# Altium project ProcessorBoard_STM32F103C.PrjPcb
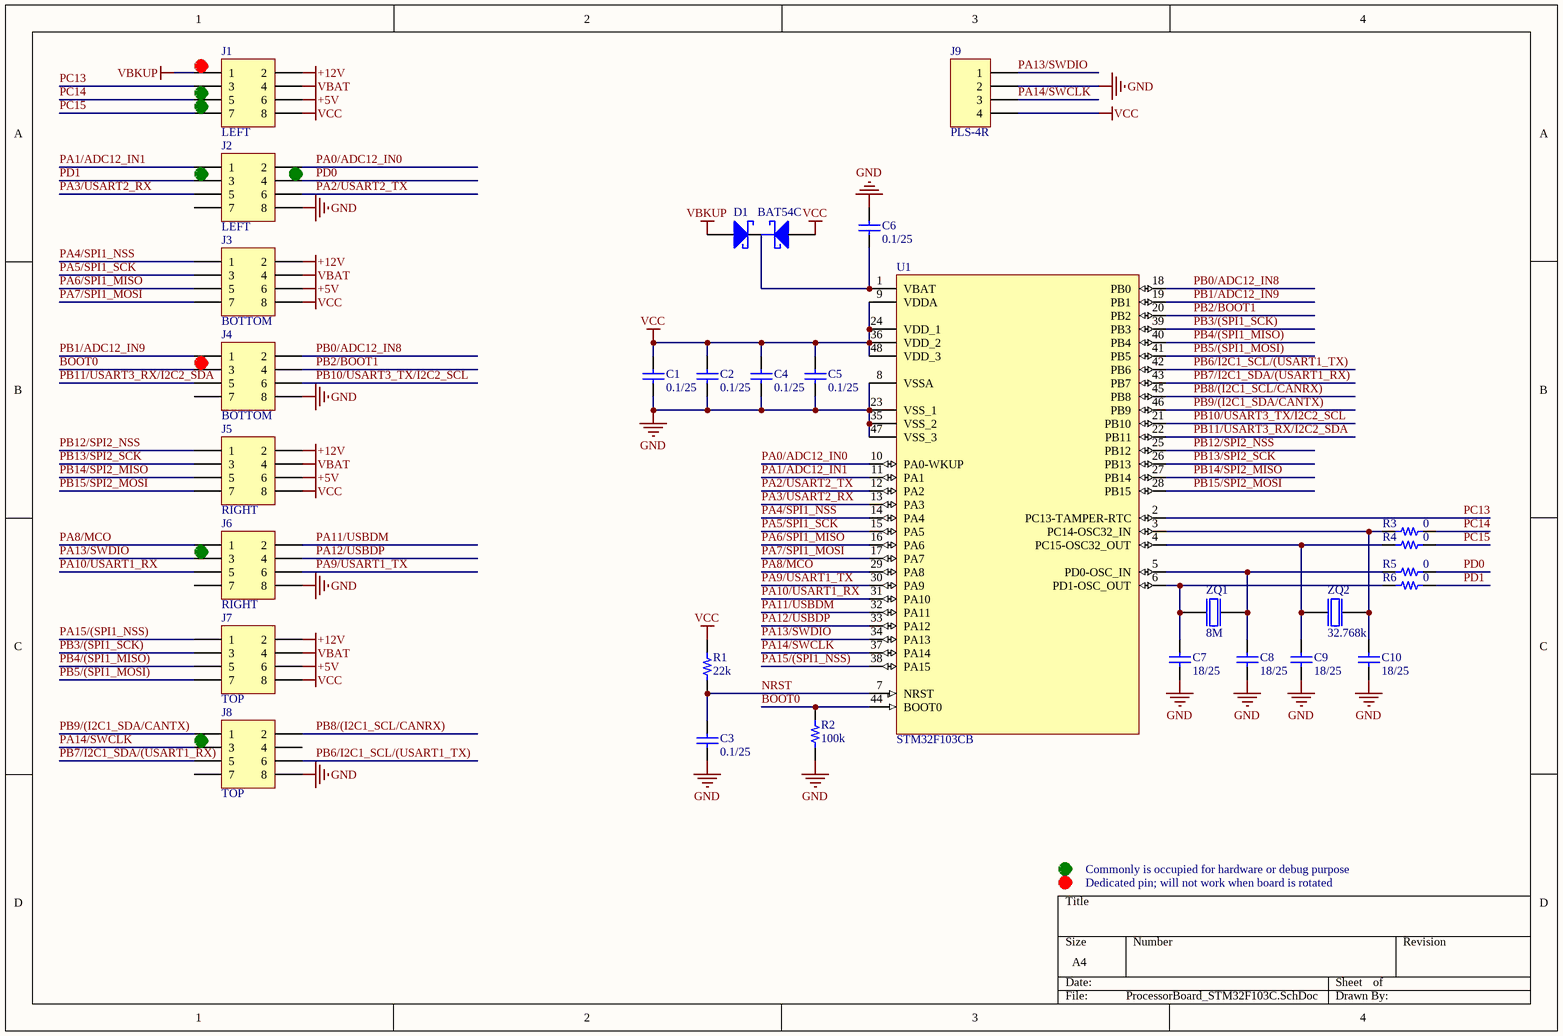
[diagram p0: ProcessorBoard_STM32F103C.SchDoc]
1 sheet, 29 parts. Net scope: global (net labels, ports and power ports of the same name join across sheets).
Board file: ProcessorBoard_STM32F103C.PcbDoc

## Sheet ProcessorBoard_STM32F103C.SchDoc
size A4

### Parts
C1  0.1/25  [CAP0402]
C2  0.1/25  [CAP0402]
C3  0.1/25  [CAP0402]
C4  0.1/25  [CAP0402]
C5  0.1/25  [CAP0402]
C6  0.1/25  [CAP0402]
C7  18/25  [CAP0402]
C8  18/25  [CAP0402]
C9  18/25  [CAP0402]
C10  18/25  [CAP0402]
D1  BAT54C  [SOT23]
J1  LEFT  [PBDM-8]
J2  LEFT  [PBDM-8]
J3  BOTTOM  [PBDM-8]
J4  BOTTOM  [PBDM-8]
J5  RIGHT  [PBDM-8]
J6  RIGHT  [PBDM-8]
J7  TOP  [PBDM-8]
J8  TOP  [PBDM-8]
J9  PLS-4R  [PLS-4R]
R1  22k  [RES0402]
R2  100k  [RES0402]
R3  0  [RES0402]
R4  0  [RES0402]
R5  0  [RES0402]
R6  0  [RES0402]
U1  STM32F103CB  [LQFP48]
ZQ1  8M  [HC49/U3H]
ZQ2  32.768k  [D6.2x2]

### Nets
+5V: J1.6 J3.6 J5.6 J7.6
+12V: J1.2 J3.2 J5.2 J7.2
GND: C1.1 C2.1 C3.1 C4.1 C5.1 C6.1 C7.1 C8.1 C9.1 C10.1 J2.8 J4.8 J6.8 J8.8 J9.2 R2.1 U1.8(VSSA) U1.23(VSS_1) U1.35(VSS_2) U1.47(VSS_3)
VBAT: J1.4 J3.4 J5.4 J7.4
VBKUP: D1.1 J1.1
VCC: C1.2 C2.2 C4.2 C5.2 D1.2 J1.8 J3.8 J5.8 J7.8 J9.4 R1.2 U1.9(VDDA) U1.24(VDD_1) U1.36(VDD_2) U1.48(VDD_3)
BOOT0: J4.3 R2.2 U1.44(BOOT0)
NRST: C3.2 R1.1 U1.7(NRST)
PA0/ADC12_IN0: J2.2 U1.10(PA0-WKUP)
PA1/ADC12_IN1: J2.1 U1.11(PA1)
PA2/USART2_TX: J2.6 U1.12(PA2)
PA3/USART2_RX: J2.5 U1.13(PA3)
PA4/SPI1_NSS: J3.1 U1.14(PA4)
PA5/SPI1_SCK: J3.3 U1.15(PA5)
PA6/SPI1_MISO: J3.5 U1.16(PA6)
PA7/SPI1_MOSI: J3.7 U1.17(PA7)
PA8/MCO: J6.1 U1.29(PA8)
PA9/USART1_TX: J6.6 U1.30(PA9)
PA10/USART1_RX: J6.5 U1.31(PA10)
PA11/USBDM: J6.2 U1.32(PA11)
PA12/USBDP: J6.4 U1.33(PA12)
PA13/SWDIO: J6.3 J9.1 U1.34(PA13)
PA14/SWCLK: J8.3 J9.3 U1.37(PA14)
PA15/(SPI1_NSS): J7.1 U1.38(PA15)
PB0/ADC12_IN8: J4.2 U1.18(PB0)
PB1/ADC12_IN9: J4.1 U1.19(PB1)
PB2/BOOT1: J4.4 U1.20(PB2)
PB3/(SPI1_SCK): J7.3 U1.39(PB3)
PB4/(SPI1_MISO): J7.5 U1.40(PB4)
PB5/(SPI1_MOSI): J7.7 U1.41(PB5)
PB6/I2C1_SCL/(USART1_TX): J8.6 U1.42(PB6)
PB7/I2C1_SDA/(USART1_RX): J8.5 U1.43(PB7)
PB8/(I2C1_SCL/CANRX): J8.2 U1.45(PB8)
PB9/(I2C1_SDA/CANTX): J8.1 U1.46(PB9)
PB10/USART3_TX/I2C2_SCL: J4.6 U1.21(PB10)
PB11/USART3_RX/I2C2_SDA: J4.5 U1.22(PB11)
PB12/SPI2_NSS: J5.1 U1.25(PB12)
PB13/SPI2_SCK: J5.3 U1.26(PB13)
PB14/SPI2_MISO: J5.5 U1.27(PB14)
PB15/SPI2_MOSI: J5.7 U1.28(PB15)
PC13: J1.3 U1.2(PC13-TAMPER-RTC)
PC14: J1.5 R3.1
PC15: J1.7 R4.1
PD0: J2.4 R5.1
PD1: J2.3 R6.1
NetC6_2: C6.2 D1.3 U1.1(VBAT)
NetC7_2: C7.2 R6.2 U1.6(PD1-OSC_OUT) ZQ1.1
NetC8_2: C8.2 R5.2 U1.5(PD0-OSC_IN) ZQ1.2
NetC9_2: C9.2 R4.2 U1.4(PC15-OSC32_OUT) ZQ2.1
NetC10_2: C10.2 R3.2 U1.3(PC14-OSC32_IN) ZQ2.2

Not connected (* = marked no-connect by the designer): J2 7; J4 7; J6 7; J8 4 7

### Notes on the sheet
- Commonly is occupied for hardware or debug purpose
- Dedicated pin; will not work when board is rotated

### Library data of the parts
C1-C6 = CAP0402: Ceramic chip capacitor 0402; Value: 0.1; Voltage: 25; PartNumber: CAP0402; Category: Capacitor; Author: oiezhov
C7-C10 = CAP0402: Ceramic chip capacitor 0402; Value: 18; Voltage: 25; PartNumber: CAP0402; Category: Capacitor; Author: oiezhov
D1 = BAT54C: Schottky diode; PartNumber: BAT54C; Category: Diode; ComponentLink1Description: Datasheet; ComponentLink1URL: d:\_AltiumLibs\Pdf\Discrete\Diode\BAT54.pdf; Author: oiezhov
J1-J8 = PBDM-8: 2x4-pin header, pitch 2.54 mm; PartNumber: PBDM-8; Category: Connector; ComponentLink1Description: Datasheet; ComponentLink1URL: d:\_AltiumLibs\Pdf\Mechanical\Connector\pbsm.pdf; Author: oiezhov
J9 = PLS-4R: 4-pin angle header, pitch 2.54 mm; PartNumber: PLS-4R; Category: Connector; ComponentLink1Description: Datasheet; ComponentLink1URL: d:\_AltiumLibs\Pdf\Mechanical\Connector\PLS, PLD.pdf; Author: oiezhov
R1-R6 = RES0402: Ceramic chip resistor; PartNumber: RES0402; Category: Resistor; Author: oiezhov
  R1: Value: 22k
  R2: Value: 100k
  R3-R6: Value: 0
U1 = STM32F103CB: General purpose 32-bit microcontroller; PartNumber: STM32F103CB; Category: IC/Microcontroller; ComponentLink1Description: Datasheet; ComponentLink1URL: d:\_AltiumLibs\Pdf\IC\Controller\STM32F103C\STM32F103CB.pdf; Author: oiezhov; ComponentLink2Description: Reference Manual; ComponentLink2URL: d:\_AltiumLibs\Pdf\IC\Controller\STM32F103C\RM0008.pdf; ComponentLink3Description: Programming manual; ComponentLink3URL: d:\_AltiumLibs\Pdf\IC\Controller\STM32F103C\PM0056.pdf; ComponentLink4Description: Errata; ComponentLink4URL: d:\_AltiumLibs\Pdf\IC\Controller\STM32F103C\ES096.pdf
ZQ1 = KX-3H: Quartz crystal in low profile package; PartNumber: KX-3H; Category: Resonators; ComponentLink1Description: Datasheet; ComponentLink1URL: d:\_AltiumLibs\Pdf\Resonator\Geyer KX-3H.pdf; Author: oiezhov; Value: 8M
ZQ2 = KX-26: Quartz crystal in cylindrical package; PartNumber: KX-26; Value: 32.768k; Category: Resonators; ComponentLink1Description: Datasheet; ComponentLink1URL: d:\_AltiumLibs\Pdf\Resonator\Geyer KX-26-V1_02.pdf; Author: oiezhov